# Altium schematic sheet ESP8266.SchDoc
size A; SheetNumber: 4; SheetTotal: 9
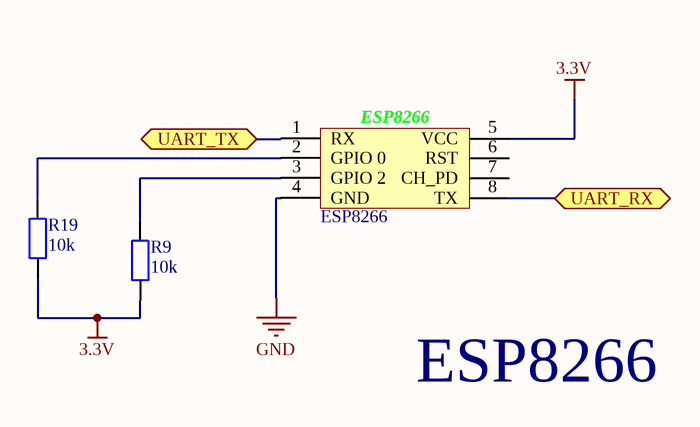
[diagram p0: ESP8266.SchDoc]

## Parts
ESP8266  ESP8266 Module  [ESP2866 Module]  (value not drawn)
R9  10k  [tro smd 0603]
R19  10k  [tro smd 0603]

## Ports
UART_RX (bidir), UART_TX (bidir)

## Nets
3.3V: ESP8266.5(VCC) R9.1 R19.1
GND: ESP8266.4(GND)
UART_RX: ESP8266.8(TX) ; port UART_RX
UART_TX: ESP8266.1(RX) ; port UART_TX
NetESP8266_2: ESP8266.2(GPIO_0) R19.2
NetESP8266_3: ESP8266.3(GPIO_2) R9.2

Not connected (* = marked no-connect by the designer): ESP8266 6(RST) 7(CH_PD)

## Notes on the sheet
- ESP8266

## Library data of the parts
R9 R19 = Tro 0603 5% 10k: Dán; Don_Vi: Con; So_Chan: 2; Ten_Linh_Kien: Trở 0603 5% 10k; Ma_Hang: MH006316; Chung_Loai: Dán; Kieu_Chan: *